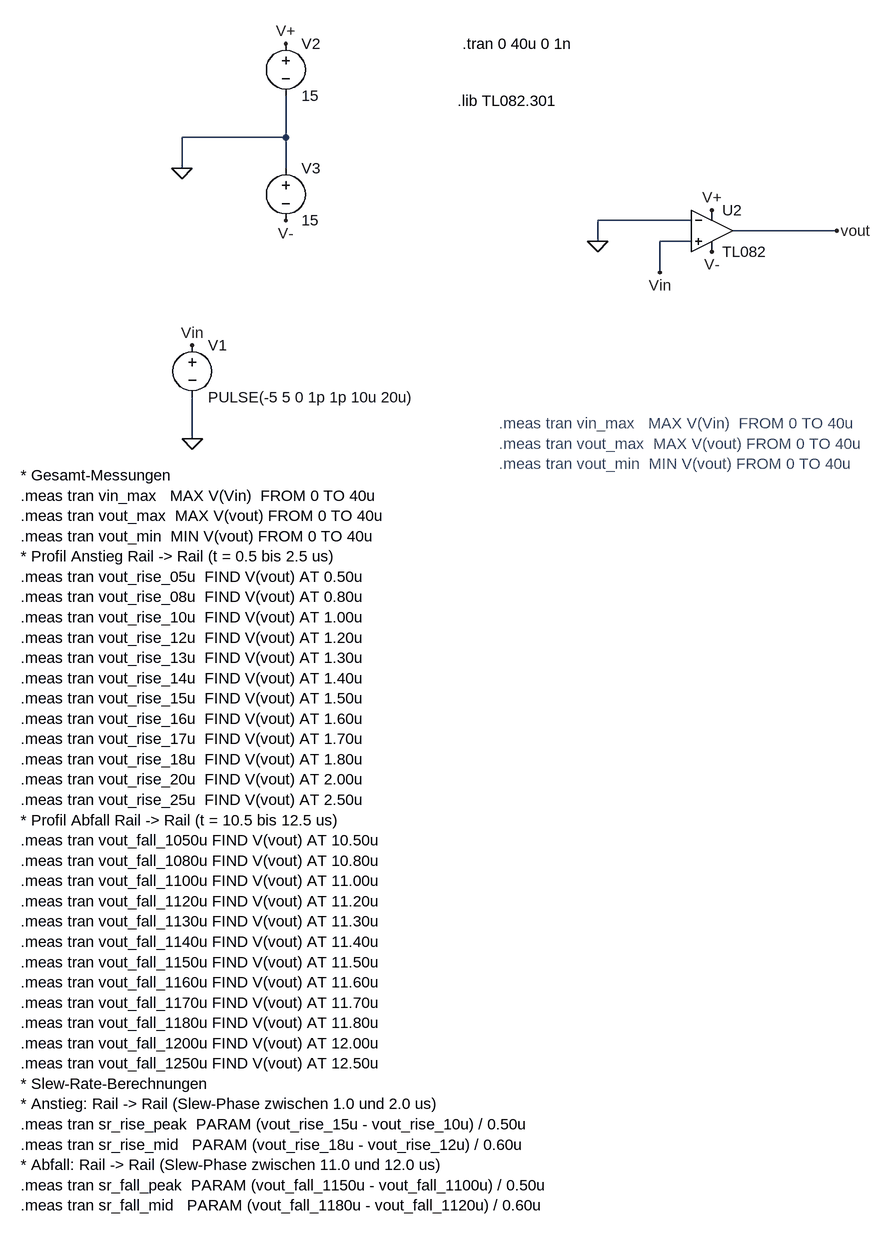
[diagram p0: schematic WORKS-non-inverting-comparator-test-slew-rate-tl802-op-amp.asc]
WORKS-non-inverting-comparator-test-slew-rate-tl802-op-amp.asc, the LTspice schematic file:
Version 4
SHEET 1 1576 1200
WIRE -560 -128 -560 -192
WIRE -560 -128 -720 -128
WIRE -720 -80 -720 -128
WIRE -560 -80 -560 -128
WIRE 64 0 -80 0
WIRE 288 16 128 16
WIRE -80 32 -80 0
WIRE 64 32 16 32
WIRE 16 80 16 32
WIRE -704 336 -704 272
FLAG 288 16 vout
FLAG 16 80 Vin
FLAG -704 336 0
FLAG -704 192 Vin
FLAG -720 -80 0
FLAG -560 0 V-
FLAG -560 -272 V+
FLAG 96 48 V-
FLAG 96 -16 V+
FLAG -80 32 0
SYMBOL voltage -704 176 R0
SYMATTR InstName V1
SYMATTR Value PULSE(-5 5 0 1p 1p 10u 20u)
SYMBOL OpAmps/opamp2 96 -48 R0
SYMATTR InstName U2
SYMATTR Value TL082
SYMBOL Voltage -560 -288 R0
SYMATTR InstName V2
SYMATTR Value 15
SYMBOL Voltage -560 -96 R0
SYMATTR InstName V3
SYMATTR Value 15
TEXT -296 -184 Left 2 !.lib TL082.301
TEXT -288 -272 Left 2 !.tran 0 40u 0 1n
TEXT -232 312 Left 2 ;.meas tran vin_max   MAX V(Vin)  FROM 0 TO 40u\n.meas tran vout_max  MAX V(vout) FROM 0 TO 40u\n.meas tran vout_min  MIN V(vout) FROM 0 TO 40u
TEXT -968 392 Left 2 !* Gesamt-Messungen\n.meas tran vin_max   MAX V(Vin)  FROM 0 TO 40u\n.meas tran vout_max  MAX V(vout) FROM 0 TO 40u\n.meas tran vout_min  MIN V(vout) FROM 0 TO 40u\n* Profil Anstieg Rail -> Rail (t = 0.5 bis 2.5 us)\n.meas tran vout_rise_05u  FIND V(vout) AT 0.50u\n.meas tran vout_rise_08u  FIND V(vout) AT 0.80u\n.meas tran vout_rise_10u  FIND V(vout) AT 1.00u\n.meas tran vout_rise_12u  FIND V(vout) AT 1.20u\n.meas tran vout_rise_13u  FIND V(vout) AT 1.30u\n.meas tran vout_rise_14u  FIND V(vout) AT 1.40u\n.meas tran vout_rise_15u  FIND V(vout) AT 1.50u\n.meas tran vout_rise_16u  FIND V(vout) AT 1.60u\n.meas tran vout_rise_17u  FIND V(vout) AT 1.70u\n.meas tran vout_rise_18u  FIND V(vout) AT 1.80u\n.meas tran vout_rise_20u  FIND V(vout) AT 2.00u\n.meas tran vout_rise_25u  FIND V(vout) AT 2.50u\n* Profil Abfall Rail -> Rail (t = 10.5 bis 12.5 us)\n.meas tran vout_fall_1050u FIND V(vout) AT 10.50u\n.meas tran vout_fall_1080u FIND V(vout) AT 10.80u\n.meas tran vout_fall_1100u FIND V(vout) AT 11.00u\n.meas tran vout_fall_1120u FIND V(vout) AT 11.20u\n.meas tran vout_fall_1130u FIND V(vout) AT 11.30u\n.meas tran vout_fall_1140u FIND V(vout) AT 11.40u\n.meas tran vout_fall_1150u FIND V(vout) AT 11.50u\n.meas tran vout_fall_1160u FIND V(vout) AT 11.60u\n.meas tran vout_fall_1170u FIND V(vout) AT 11.70u\n.meas tran vout_fall_1180u FIND V(vout) AT 11.80u\n.meas tran vout_fall_1200u FIND V(vout) AT 12.00u\n.meas tran vout_fall_1250u FIND V(vout) AT 12.50u\n* Slew-Rate-Berechnungen\n* Anstieg: Rail -> Rail (Slew-Phase zwischen 1.0 und 2.0 us)\n.meas tran sr_rise_peak  PARAM (vout_rise_15u - vout_rise_10u) / 0.50u\n.meas tran sr_rise_mid   PARAM (vout_rise_18u - vout_rise_12u) / 0.60u\n* Abfall: Rail -> Rail (Slew-Phase zwischen 11.0 und 12.0 us)\n.meas tran sr_fall_peak  PARAM (vout_fall_1150u - vout_fall_1100u) / 0.50u\n.meas tran sr_fall_mid   PARAM (vout_fall_1180u - vout_fall_1120u) / 0.60u

The netlist it stands for:
* WORKS-non-inverting-comparator-test-slew-rate-tl802-op-amp.asc
V1 Vin 0 PULSE(-5 5 0 1p 1p 10u 20u)
XU2 Vin 0 V+ V- vout TL082  ; pins In+ In- V+ V- OUT
V2 V+ 0 15
V3 0 V- 15
.lib TL082.301
.tran 0 40u 0 1n
* .meas tran vin_max   MAX V(Vin)  FROM 0 TO 40u
* .meas tran vout_max  MAX V(vout) FROM 0 TO 40u
* .meas tran vout_min  MIN V(vout) FROM 0 TO 40u
* Gesamt-Messungen
.meas tran vin_max   MAX V(Vin)  FROM 0 TO 40u
.meas tran vout_max  MAX V(vout) FROM 0 TO 40u
.meas tran vout_min  MIN V(vout) FROM 0 TO 40u
* Profil Anstieg Rail -> Rail (t = 0.5 bis 2.5 us)
.meas tran vout_rise_05u  FIND V(vout) AT 0.50u
.meas tran vout_rise_08u  FIND V(vout) AT 0.80u
.meas tran vout_rise_10u  FIND V(vout) AT 1.00u
.meas tran vout_rise_12u  FIND V(vout) AT 1.20u
.meas tran vout_rise_13u  FIND V(vout) AT 1.30u
.meas tran vout_rise_14u  FIND V(vout) AT 1.40u
.meas tran vout_rise_15u  FIND V(vout) AT 1.50u
.meas tran vout_rise_16u  FIND V(vout) AT 1.60u
.meas tran vout_rise_17u  FIND V(vout) AT 1.70u
.meas tran vout_rise_18u  FIND V(vout) AT 1.80u
.meas tran vout_rise_20u  FIND V(vout) AT 2.00u
.meas tran vout_rise_25u  FIND V(vout) AT 2.50u
* Profil Abfall Rail -> Rail (t = 10.5 bis 12.5 us)
.meas tran vout_fall_1050u FIND V(vout) AT 10.50u
.meas tran vout_fall_1080u FIND V(vout) AT 10.80u
.meas tran vout_fall_1100u FIND V(vout) AT 11.00u
.meas tran vout_fall_1120u FIND V(vout) AT 11.20u
.meas tran vout_fall_1130u FIND V(vout) AT 11.30u
.meas tran vout_fall_1140u FIND V(vout) AT 11.40u
.meas tran vout_fall_1150u FIND V(vout) AT 11.50u
.meas tran vout_fall_1160u FIND V(vout) AT 11.60u
.meas tran vout_fall_1170u FIND V(vout) AT 11.70u
.meas tran vout_fall_1180u FIND V(vout) AT 11.80u
.meas tran vout_fall_1200u FIND V(vout) AT 12.00u
.meas tran vout_fall_1250u FIND V(vout) AT 12.50u
* Slew-Rate-Berechnungen
* Anstieg: Rail -> Rail (Slew-Phase zwischen 1.0 und 2.0 us)
.meas tran sr_rise_peak  PARAM (vout_rise_15u - vout_rise_10u) / 0.50u
.meas tran sr_rise_mid   PARAM (vout_rise_18u - vout_rise_12u) / 0.60u
* Abfall: Rail -> Rail (Slew-Phase zwischen 11.0 und 12.0 us)
.meas tran sr_fall_peak  PARAM (vout_fall_1150u - vout_fall_1100u) / 0.50u
.meas tran sr_fall_mid   PARAM (vout_fall_1180u - vout_fall_1120u) / 0.60u
.backanno
.end